# EasyEDA Pro project FOC12.epro, schematic Schematic1
Board Name: 驱动板; Create Date: 2024-12-24; Page Name: P1; Project Name: FOC12; Schematic Name: Schematic1; Update Date: 2025-05-16; Company: 嘉立创EDA; Drawed: Solituder; Page Size: A4; Version: V8.0
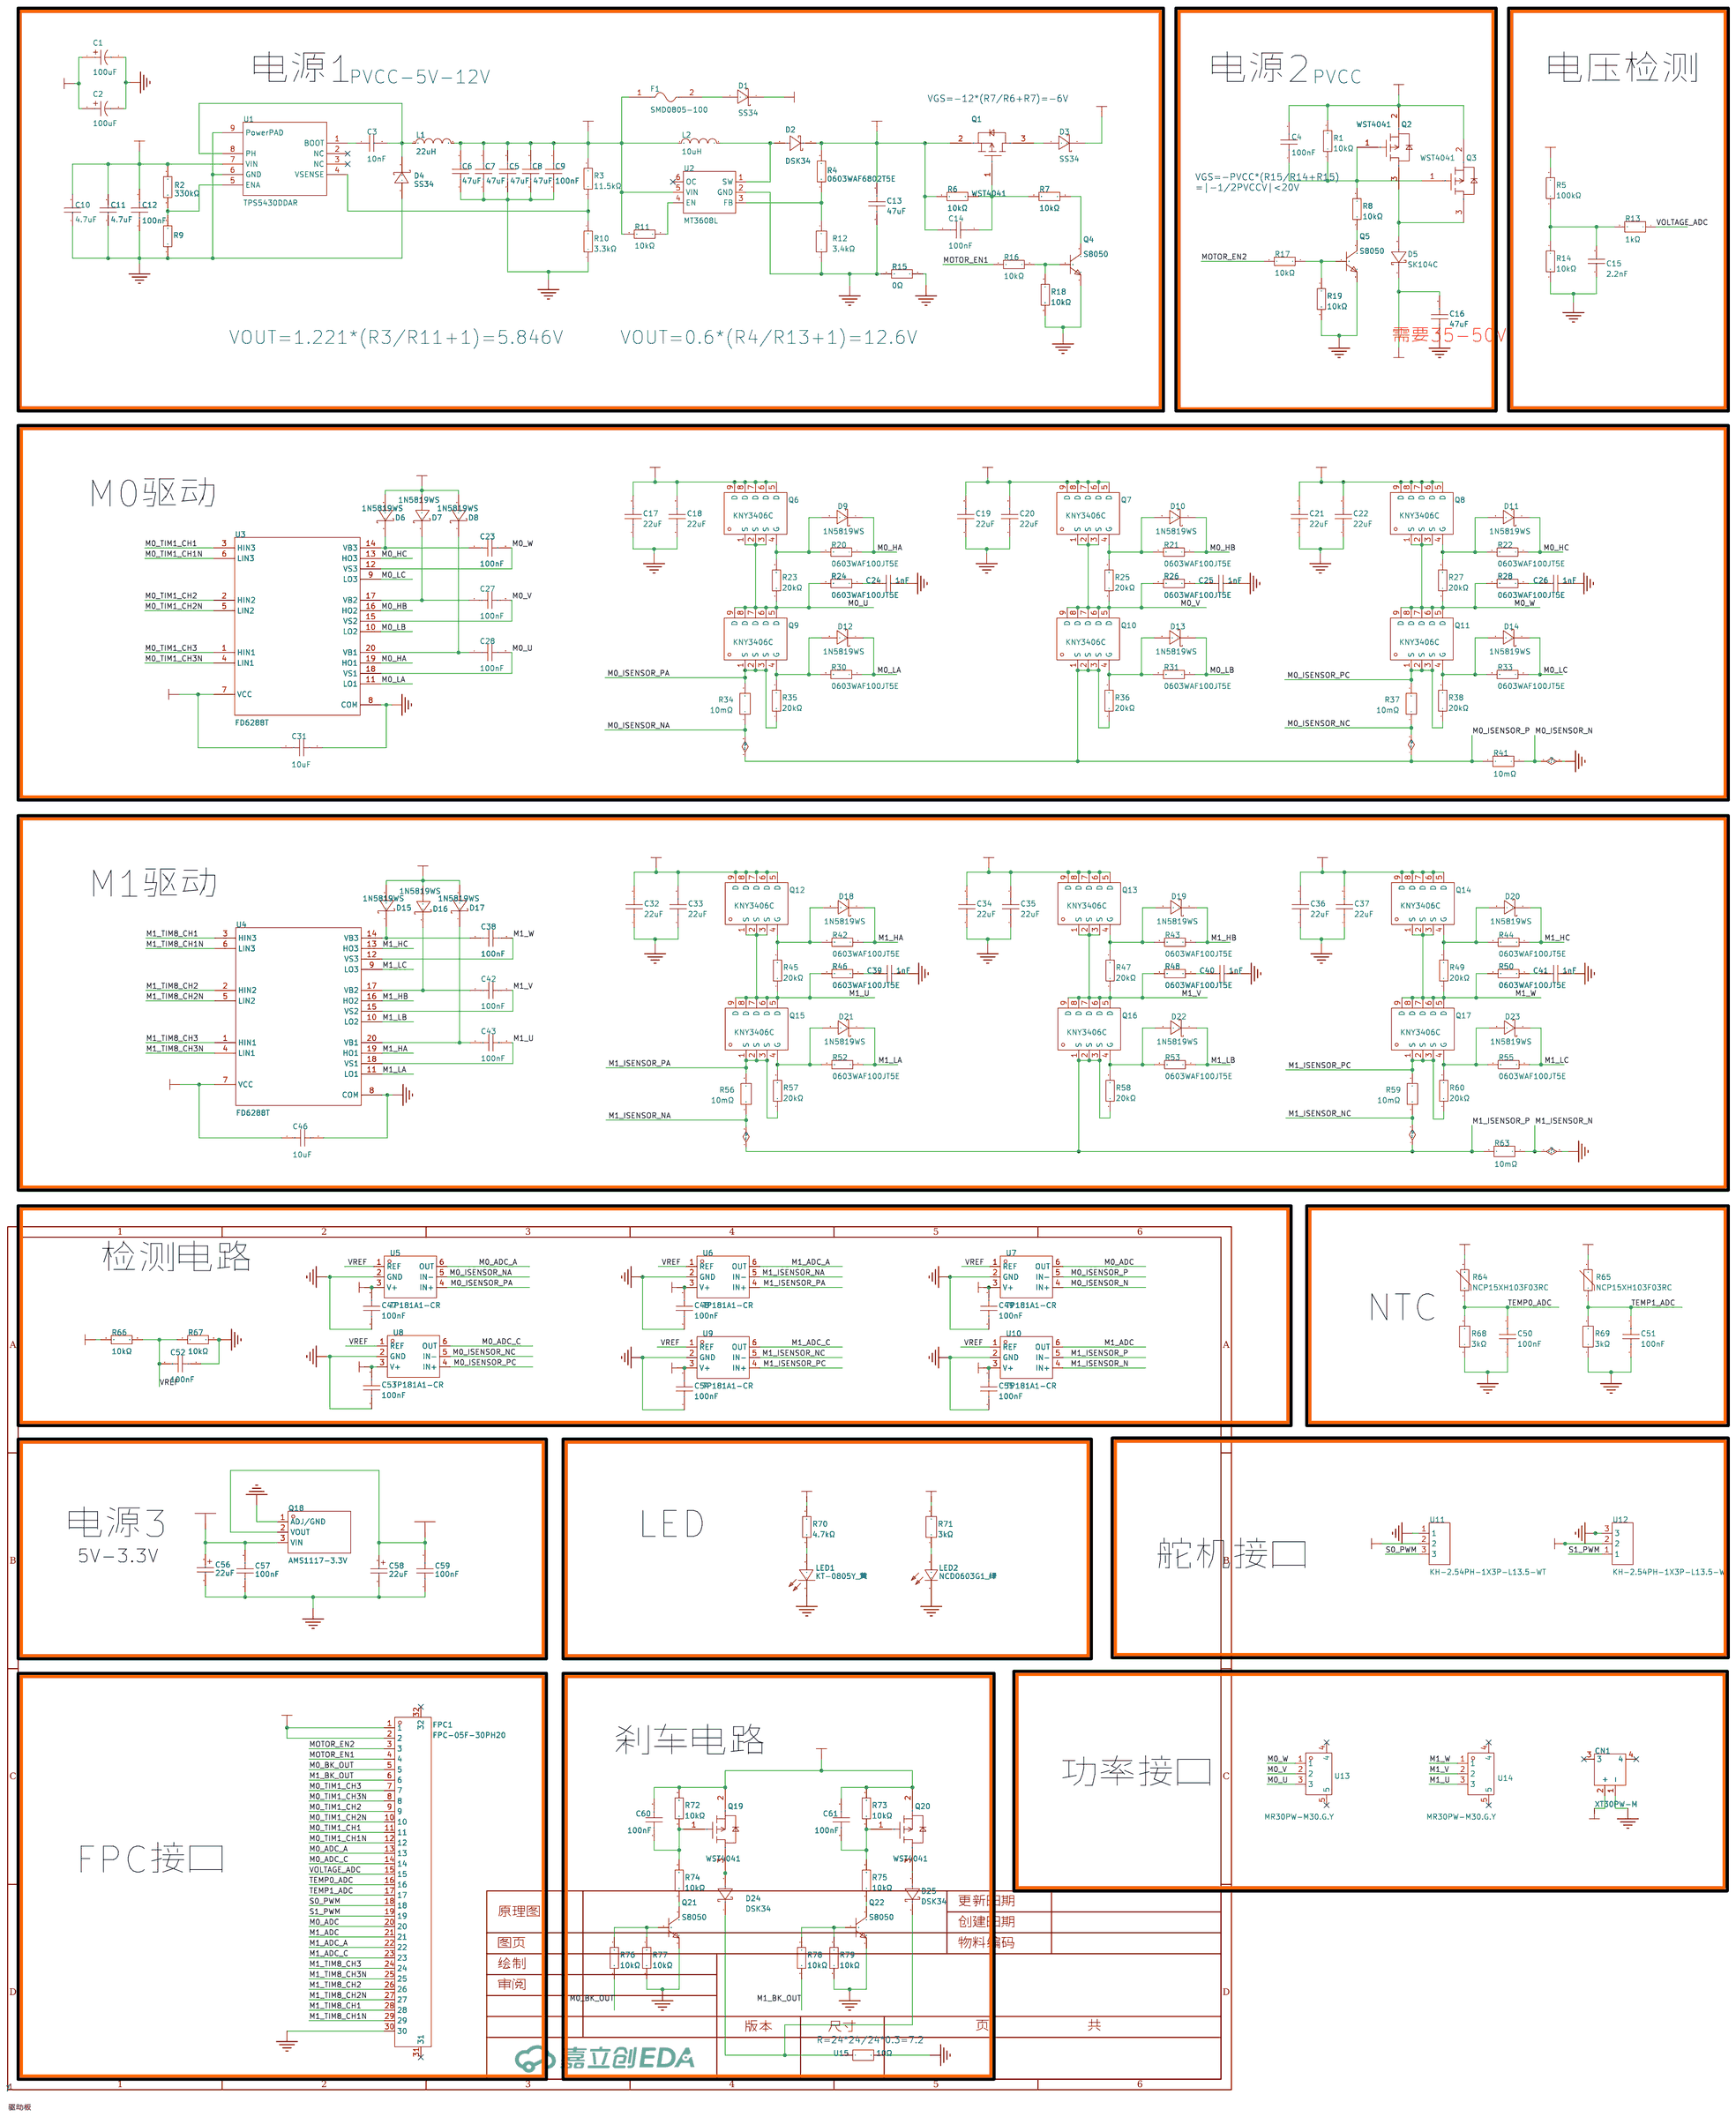
[diagram p0: schematic sheet]

## Parts
C1  100uF  [CAP-SMD_BD10.0-L10.3-W10.3-FD]
C2  100uF  [CAP-SMD_BD10.0-L10.3-W10.3-FD]
C3  10nF  [C0603]
C4  100nF  [C0603]
C5  47uF  [C1206]
C6  47uF  [C1206]
C7  47uF  [C1206]
C8  47uF  [C1206]
C9  100nF  [C0603]
C10  4.7uF  [C0805]
C11  4.7uF  [C0805]
C12  100nF  [C0603]
C13  47uF  [C1206]
C14  100nF  [C0603]
C15  2.2nF  [C0402]
C16  47uF  [C1206]
C17  22uF  [C1206]
C18  22uF  [C1206]
C19  22uF  [C1206]
C20  22uF  [C1206]
C21  22uF  [C1206]
C22  22uF  [C1206]
C23  100nF  [C0603]
C24  1nF  [C0402]
C25  1nF  [C0402]
C26  1nF  [C0402]
C27  100nF  [C0603]
C28  100nF  [C0603]
C31  10uF  [C0805]
C32  22uF  [C1206]
C33  22uF  [C1206]
C34  22uF  [C1206]
C35  22uF  [C1206]
C36  22uF  [C1206]
C37  22uF  [C1206]
C38  100nF  [C0603]
C39  1nF  [C0402]
C40  1nF  [C0402]
C41  1nF  [C0402]
C42  100nF  [C0603]
C43  100nF  [C0603]
C46  10uF  [C0805]
C47  100nF  [C0402]
C48  100nF  [C0402]
C49  100nF  [C0402]
C50  100nF  [C0603]
C51  100nF  [C0603]
C52  100nF  [C0402]
C53  100nF  [C0402]
C54  100nF  [C0402]
C55  100nF  [C0402]
C56  22uF  [CASE-A_3216]
C57  100nF  [C0603]
C58  22uF  [CASE-A_3216]
C59  100nF  [C0603]
C60  100nF  [C0603]
C61  100nF  [C0603]
CN1  XT30PW-M  [CONN-TH_XT30PW-M]
D1  SS34  [SMA_L4.3-W2.6-LS5.2-RD]
D2  DSK34  [SOD-123FL_L2.7-W1.8-LS3.8-RD]
D3  SS34  [SMA_L4.3-W2.6-LS5.2-RD]
D4  SS34  [SMA_L4.3-W2.6-LS5.2-RD]
D5  SK104C  [SMC_L6.9-W5.9-LS7.9-RD]
D6  1N5819WS  [SOD-323_L1.8-W1.3-LS2.5-RD]
D7  1N5819WS  [SOD-323_L1.8-W1.3-LS2.5-RD]
D8  1N5819WS  [SOD-323_L1.8-W1.3-LS2.5-RD]
D9  1N5819WS  [SOD-323_L1.8-W1.3-LS2.5-RD]
D10  1N5819WS  [SOD-323_L1.8-W1.3-LS2.5-RD]
D11  1N5819WS  [SOD-323_L1.8-W1.3-LS2.5-RD]
D12  1N5819WS  [SOD-323_L1.8-W1.3-LS2.5-RD]
D13  1N5819WS  [SOD-323_L1.8-W1.3-LS2.5-RD]
D14  1N5819WS  [SOD-323_L1.8-W1.3-LS2.5-RD]
D15  1N5819WS  [SOD-323_L1.8-W1.3-LS2.5-RD]
D16  1N5819WS  [SOD-323_L1.8-W1.3-LS2.5-RD]
D17  1N5819WS  [SOD-323_L1.8-W1.3-LS2.5-RD]
D18  1N5819WS  [SOD-323_L1.8-W1.3-LS2.5-RD]
D19  1N5819WS  [SOD-323_L1.8-W1.3-LS2.5-RD]
D20  1N5819WS  [SOD-323_L1.8-W1.3-LS2.5-RD]
D21  1N5819WS  [SOD-323_L1.8-W1.3-LS2.5-RD]
D22  1N5819WS  [SOD-323_L1.8-W1.3-LS2.5-RD]
D23  1N5819WS  [SOD-323_L1.8-W1.3-LS2.5-RD]
D24  DSK34  [SOD-123FL_L2.7-W1.8-LS3.8-RD]
D25  DSK34  [SOD-123FL_L2.7-W1.8-LS3.8-RD]
F1  SMD0805-100  [F0805]
FPC1  FPC-05F-30PH20  [FPC-SMD_30P-P0.50_XUNPU_FPC-05F-30PH20]
L1  22uH  [IND-SMD_L7.3-W6.6_MHCI06030]
L2  10uH  [IND-SMD_L5.4-W5.2_FXL0530]
LED1  KT-0805Y_黄  [LED0805-R-RD]
LED2  NCD0603G1_绿  [LED0603-RD_1]
Q1  WST4041  [SOT-23_L2.9-W1.3-P1.90-LS2.4-BR]
Q2  WST4041  [SOT-23_L2.9-W1.3-P1.90-LS2.4-BR]
Q3  WST4041  [SOT-23_L2.9-W1.3-P1.90-LS2.4-BR]
Q4  S8050  [SOT-23-3_L2.9-W1.3-P1.90-LS2.4-BR]
Q5  S8050  [SOT-23-3_L2.9-W1.3-P1.90-LS2.4-BR]
Q6  KNY3406C  [PDFN-8_L4.9-W5.8-P1.27-LS6.1-BL]
Q7  KNY3406C  [PDFN-8_L4.9-W5.8-P1.27-LS6.1-BL]
Q8  KNY3406C  [PDFN-8_L4.9-W5.8-P1.27-LS6.1-BL]
Q9  KNY3406C  [PDFN-8_L4.9-W5.8-P1.27-LS6.1-BL]
Q10  KNY3406C  [PDFN-8_L4.9-W5.8-P1.27-LS6.1-BL]
Q11  KNY3406C  [PDFN-8_L4.9-W5.8-P1.27-LS6.1-BL]
Q12  KNY3406C  [PDFN-8_L4.9-W5.8-P1.27-LS6.1-BL]
Q13  KNY3406C  [PDFN-8_L4.9-W5.8-P1.27-LS6.1-BL]
Q14  KNY3406C  [PDFN-8_L4.9-W5.8-P1.27-LS6.1-BL]
Q15  KNY3406C  [PDFN-8_L4.9-W5.8-P1.27-LS6.1-BL]
Q16  KNY3406C  [PDFN-8_L4.9-W5.8-P1.27-LS6.1-BL]
Q17  KNY3406C  [PDFN-8_L4.9-W5.8-P1.27-LS6.1-BL]
Q18  AMS1117-3.3V  [SOT-89-3_L4.5-W2.5-P1.50-LS4.2-BR]
Q19  WST4041  [SOT-23_L2.9-W1.3-P1.90-LS2.4-BR]
Q20  WST4041  [SOT-23_L2.9-W1.3-P1.90-LS2.4-BR]
Q21  S8050  [SOT-23-3_L2.9-W1.3-P1.90-LS2.4-BR]
Q22  S8050  [SOT-23-3_L2.9-W1.3-P1.90-LS2.4-BR]
R1  10kΩ  [R0402]
R2  330kΩ  [R0603]
R3  11.5kΩ  [R0402]
R4  0603WAF6802T5E  [R0603]
R5  100kΩ  [R0402]
R6  10kΩ  [R0402]
R7  10kΩ  [R0402]
R8  10kΩ  [R0402]
R9  0603WAF6802T5E  [R0603]
R10  3.3kΩ  [R0402]
R11  10kΩ  [R0402]
R12  3.4kΩ  [R0603]
R13  1kΩ  [R0402]
R14  10kΩ  [R0402]
R15  0Ω  [R0603]
R16  10kΩ  [R0402]
R17  10kΩ  [R0402]
R18  10kΩ  [R0402]
R19  10kΩ  [R0402]
R20  0603WAF100JT5E  [R0603]
R21  0603WAF100JT5E  [R0603]
R22  0603WAF100JT5E  [R0603]
R23  20kΩ  [R0402]
R24  0603WAF100JT5E  [R0603]
R25  20kΩ  [R0402]
R26  0603WAF100JT5E  [R0603]
R27  20kΩ  [R0402]
R28  0603WAF100JT5E  [R0603]
R30  0603WAF100JT5E  [R0603]
R31  0603WAF100JT5E  [R0603]
R33  0603WAF100JT5E  [R0603]
R34  10mΩ  [R2512]
R35  20kΩ  [R0402]
R36  20kΩ  [R0402]
R37  10mΩ  [R2512]
R38  20kΩ  [R0402]
R41  10mΩ  [R2512]
R42  0603WAF100JT5E  [R0603]
R43  0603WAF100JT5E  [R0603]
R44  0603WAF100JT5E  [R0603]
R45  20kΩ  [R0402]
R46  0603WAF100JT5E  [R0603]
R47  20kΩ  [R0402]
R48  0603WAF100JT5E  [R0603]
R49  20kΩ  [R0402]
R50  0603WAF100JT5E  [R0603]
R52  0603WAF100JT5E  [R0603]
R53  0603WAF100JT5E  [R0603]
R55  0603WAF100JT5E  [R0603]
R56  10mΩ  [R2512]
R57  20kΩ  [R0402]
R58  20kΩ  [R0402]
R59  10mΩ  [R2512]
R60  20kΩ  [R0402]
R63  10mΩ  [R2512]
R64  NCP15XH103F03RC  [R0402]
R65  NCP15XH103F03RC  [R0402]
R66  10kΩ  [R0402]
R67  10kΩ  [R0402]
R68  3kΩ  [R0402]
R69  3kΩ  [R0402]
R70  4.7kΩ  [R0402]
R71  3kΩ  [R0402]
R72  10kΩ  [R0402]
R73  10kΩ  [R0402]
R74  10kΩ  [R0402]
R75  10kΩ  [R0402]
R76  10kΩ  [R0402]
R77  10kΩ  [R0402]
R78  10kΩ  [R0402]
R79  10kΩ  [R0402]
U1  TPS5430DDAR  [ESOP-8_L4.9-W3.9-P1.27-LS6.0-TL-EP]
U2  MT3608L  [SOT-23-6_L2.9-W1.6-P0.95-LS2.8-BL_3]
U3  FD6288T  [TSSOP-20_L6.5-W4.4-P0.65-LS6.4-BL]
U4  FD6288T  [TSSOP-20_L6.5-W4.4-P0.65-LS6.4-BL]
U5  TP181A1-CR  [SC70-6_L2.1-W1.3-P0.65-LS2.3-BL]
U6  TP181A1-CR  [SC70-6_L2.1-W1.3-P0.65-LS2.3-BL]
U7  TP181A1-CR  [SC70-6_L2.1-W1.3-P0.65-LS2.3-BL]
U8  TP181A1-CR  [SC70-6_L2.1-W1.3-P0.65-LS2.3-BL]
U9  TP181A1-CR  [SC70-6_L2.1-W1.3-P0.65-LS2.3-BL]
U10  TP181A1-CR  [SC70-6_L2.1-W1.3-P0.65-LS2.3-BL]
U11  KH-2.54PH-1X3P-L13.5-WT  [HDR-SMD_3P-P2.54-H-M_KH-2.54PH-1X3P-L13.5-WT]
U12  KH-2.54PH-1X3P-L13.5-WT  [HDR-SMD_3P-P2.54-H-M_KH-2.54PH-1X3P-L13.5-WT]
U13  MR30PW-M30.G.Y  [CONN-TH_MR30PW-M30-G-Y]
U14  MR30PW-M30.G.Y  [CONN-TH_MR30PW-M30-G-Y]
U15  10Ω  [TO-220-2_L10.1-W4.5-P5.08-L]

## Library data of the parts
C1 C2 = VMME0841J101MV: 容值:100uF;精度:±20%;额定电压:63V;纹波电流:-;等效串联电阻:-;; LCSC Part Name: 100uF ±20% 63V; Supplier Part: C487129; Manufacturer: Ymin(永铭); Supplier Footprint: SMD,D10xL8.4mm; Datasheet: https://atta.szlcsc.com/upload/public/pdf/source/20200220/C487283_B2B02AE81BD8A6F1FEC0F15CA59E8094.pdf; Supplier: LCSC; Tolerance: ±20%; Rated Voltage: 63V
C3 = CC0603JRX7R9BB103: 容值:10nF;精度:±5%;额定电压:50V;材质(温度系数):X7R;; LCSC Part Name: 10nF ±5% 50V; Supplier Part: C115056; Manufacturer: YAGEO(国巨); Supplier Footprint: 0603; Datasheet: https://atta.szlcsc.com/upload/public/pdf/source/20170810/C115056_1502335171390879692.pdf; Supplier: LCSC; Tolerance: ±5%; Voltage Rated: 50V; Temperature Coefficient: X7R
C4 C9 C12 C14 C23 C27 C28 C38 C42 C43 C50 C51 C57 C59-C61 = CC0603KRX7R9BB104: 容值:100nF;精度:±10%;额定电压:50V;材质(温度系数):X7R;; LCSC Part Name: 100nF ±10% 50V; Supplier Part: C14663; Manufacturer: YAGEO(国巨); Supplier Footprint: 0603; Datasheet: https://atta.szlcsc.com/upload/public/pdf/source/20170116/1484561234239.pdf; Supplier: LCSC; Tolerance: ±10%; Voltage Rated: 50V; Temperature Coefficient: X7R
C5-C8 C16 = HGC1206R5476M100NSPJ: 容值:47uF;精度:±20%;额定电压:10V;材质(温度系数):X5R;; LCSC Part Name: 47uF ±20% 10V; Supplier Part: C7432787; Manufacturer: Chinocera(华瓷); Supplier Footprint: 1206; Datasheet: https://atta.szlcsc.com/upload/public/pdf/source/20240320/FAC3FEC40A78BC5CCCE96C232A94D860.pdf; Supplier: LCSC; Tolerance: ±20%; Voltage Rated: 10V; Temperature Coefficient: X5R
C10 C11 = CL21A475KBQNNNE: 容值:4.7uF;精度:±10%;额定电压:50V;材质(温度系数):X5R;; LCSC Part Name: 4.7uF ±10% 50V; Supplier Part: C98192; Manufacturer: SAMSUNG(三星); Supplier Footprint: 0805; JLCPCB Part Class: Extended Part; Datasheet: https://atta.szlcsc.com/upload/public/pdf/source/20170412/1491969149396.pdf; Supplier: LCSC; Tolerance: ±10%; Voltage Rated: 50V; Temperature Coefficient: X5R
C13 = HGC1206R5476M250NSPJ: 容值:47uF;精度:±20%;额定电压:25V;材质(温度系数):X5R;; LCSC Part Name: 47uF ±20% 25V; Supplier Part: C22367835; Manufacturer: Chinocera(华瓷); Supplier Footprint: 1206; JLCPCB Part Class: 扩展库; Datasheet: https://atta.szlcsc.com/upload/public/pdf/source/20240326/E6CB0DC43BB858B74F4352229FABFDCA.pdf; Supplier: LCSC; Tolerance: ±20%; Voltage Rated: 25V; Temperature Coefficient: X5R
C15 = 0402B222K500NT: 容值:2.2nF;精度:±10%;额定电压:50V;材质(温度系数):X7R;; LCSC Part Name: 2.2nF ±10% 50V; Supplier Part: C1531; Manufacturer: FH(风华); Supplier Footprint: 0402; JLCPCB Part Class: Basic Part; Datasheet: https://atta.szlcsc.com/upload/public/pdf/source/20170923/C1531_1506149258433988338.pdf; Supplier: LCSC; Tolerance: ±10%; Voltage Rated: 50V; Temperature Coefficient: X7R
C17-C22 C32-C37 = CGA1206X5R226M350NT: 容值:22uF;精度:±20%;额定电压:35V;材质(温度系数):X5R;; LCSC Part Name: 22uF ±20% 35V; Supplier Part: C6119969; Manufacturer: HRE(芯声); Supplier Footprint: 1206; JLCPCB Part Class: 扩展库; Supplier: LCSC; Tolerance: ±20%; Voltage Rated: 35V; Temperature Coefficient: X5R
C24-C26 C39-C41 = CC0402KRX7R9BB102: 容值:1nF;精度:±10%;额定电压:50V;材质(温度系数):X7R;; LCSC Part Name: 1nF ±10% 50V; Supplier Part: C106205; Manufacturer: YAGEO(国巨); Supplier Footprint: 0402; JLCPCB Part Class: Extended Part; Datasheet: https://atta.szlcsc.com/upload/public/pdf/source/20171226/C106205_15142609593391205665.pdf; Supplier: LCSC; Tolerance: ±10%; Voltage Rated: 50V; Temperature Coefficient: X7R
C31 C46 = HGC0805R5106K500NSLJ: 容值:10uF;精度:±10%;额定电压:50V;材质(温度系数):X5R;; LCSC Part Name: 10uF ±10% 50V; Supplier Part: C22367830; Manufacturer: Chinocera(华瓷); Supplier Footprint: 0805; JLCPCB Part Class: Extended Part; Datasheet: https://atta.szlcsc.com/upload/public/pdf/source/20240326/4C0A3E12027C78BBE9280625046EA2CF.pdf; Supplier: LCSC; Tolerance: ±10%; Voltage Rated: 50V; Temperature Coefficient: X5R
C47-C49 C52-C55 = CL05B104KO5NNNC: 容值:100nF;精度:±10%;额定电压:16V;材质(温度系数):X7R;; LCSC Part Name: 100nF ±10% 16V; Supplier Part: C1525; Manufacturer: SAMSUNG(三星); Supplier Footprint: 0402; JLCPCB Part Class: 基础库; Datasheet: https://atta.szlcsc.com/upload/public/pdf/source/20160218/1457707763339.pdf; Supplier: LCSC; Tolerance: ±10%; Voltage Rated: 16V; Temperature Coefficient: X7R
C56 C58 = TAJA226K010RNJ: 容值:22uF;精度:±10%;额定电压:10V;等效串联电阻:3Ω@100kHz;; LCSC Part Name: 22uF ±10% 10V; Supplier Part: C11366; Manufacturer: Kyocera AVX; Supplier Footprint: CASE-A-3216; JLCPCB Part Class: Extended Part; Datasheet: https://atta.szlcsc.com/upload/public/pdf/source/20160107/1457707750344.pdf; Supplier: LCSC; Tolerance: ±10%; Rated Voltage: 10V; Equivalent Series Resistance(ESR): 3Ω@100kHz; Operating Temperature: -55℃~+125℃
CN1 = XT30PW-M: Socket,DCsupply,XT30,male,PIN:2; LCSC Part Name: XT30PW-M公头; Supplier Part: C431092; Manufacturer: AMASS(艾迈斯); Supplier Footprint: Through Hole; Datasheet: https://atta.szlcsc.com/upload/public/pdf/source/20220222/6A9F22F7850E25B33E1BE430ADF8560B.pdf; Supplier: LCSC
D1 D3 D4 = SS34_C8678: 二极管配置:独立式;正向压降(Vf):550mV@3A;直流反向耐压(Vr):40V;整流电流:3A;; LCSC Part Name: 电压:40V 电流:3A; Supplier Part: C8678; Manufacturer: MDD(辰达半导体); Supplier Footprint: SMA(DO-214AC); JLCPCB Part Class: 基础库; Datasheet: https://atta.szlcsc.com/upload/public/pdf/source/20230314/A80AE34493C69B89E2F4B1712F433538.pdf; Supplier: LCSC; Diode Configuration: 独立式; Forward Voltage (Vf@If): 550mV@3A; Reverse Voltage (Vr): 40V; Rectified Current: 3A; Reverse Leakage Current (Ir): 500uA@40V
D2 D24 D25 = DSK34_C7502709: 二极管配置:独立式;正向压降(Vf):550mV@3A;直流反向耐压(Vr):40V;整流电流:3A;; LCSC Part Name: 电压:40V 电流:3A; Supplier Part: C7502709; Manufacturer: 宏迦橙; Supplier Footprint: SOD-123FL; Datasheet: https://atta.szlcsc.com/upload/public/pdf/source/20240814/5E8D2EAF2EE69BEF369BE6AC64F67CC4.pdf; Supplier: LCSC; Diode Configuration: 独立式; Forward Voltage (Vf@If): 550mV@3A; Reverse Voltage (Vr): 40V; Rectified Current: 3A; Reverse Leakage Current (Ir): 500uA
D5 = SK104C_C18199211: 二极管配置:独立式;正向压降(Vf):550mV@10A;直流反向耐压(Vr):40V;整流电流:10A;; LCSC Part Name: 电压:40V 电流:10A; Supplier Part: C18199211; Manufacturer: 宏迦橙; Supplier Footprint: SMC; JLCPCB Part Class: 扩展库; Datasheet: https://atta.szlcsc.com/upload/public/pdf/source/20230925/90F2340DC9BC2B2517F18AABBBD1A464.pdf; Supplier: LCSC; Diode Configuration: 独立式; Forward Voltage (Vf@If): 550mV@10A; Reverse Voltage (Vr): 40V; Rectified Current: 10A; Reverse Leakage Current (Ir): 500uA@40V
D6-D23 = 1N5819WS_C191023: 直流反向耐压(Vr):40V;平均整流电流(Io):1A;正向压降(Vf):600mV@1A;; LCSC Part Name: 40V 1A 600mV@1A; Supplier Part: C191023; Manufacturer: Hottech(合科泰); Supplier Footprint: SOD-323; Datasheet: https://atta.szlcsc.com/upload/public/pdf/source/20180614/C191023_3C6A6398B911F3A4C23E7538EE054643.pdf; Supplier: LCSC; Reverse Voltage (Vr): 40V; Average Rectified Current (Io): 1A; Forward Voltage (Vf@If): 600mV@1A
F1 = SMD0805-100: 最大电压:6V;最大电流:100A;保持电流:1A;跳闸电流:1.95A;; LCSC Part Name: 1A  6V 自恢复保险丝; Supplier Part: C70061; Manufacturer: 台湾陆海; Supplier Footprint: 0805; JLCPCB Part Class: Extended Part; Datasheet: https://atta.szlcsc.com/upload/public/pdf/source/20160331/1459396375879.pdf; Supplier: LCSC; Operating Voltage (Max): 6V; Current Rating (Max): 100A; Hold Current: 1A; Trip Current: 1.95A
FPC1 = FPC-05F-30PH20: 锁定特性:翻盖式;触点类型:下接;触点数量:30P;间距:0.5mm;安装类型:卧贴;工作温度范围:-25℃~+85℃;; LCSC Part Name: 间距:0.5mm P数:30P 翻盖式 下接; Supplier Part: C2856808; Manufacturer: XUNPU(讯普); Supplier Footprint: SMD,P=0.5mm,卧贴; JLCPCB Part Class: 扩展库; Datasheet: https://atta.szlcsc.com/upload/public/pdf/source/20210922/C2856808_4E6DDE2793CFD9EF09B771A8BD3338A4.pdf; Supplier: LCSC; Locking Feature: 翻盖式; Contact Type: 下接; Number of Contacts: 30P; Pitch: 0.5mm; Mounting Type: 卧贴; FFC, FCB Thickness: 0.3mm; Height Above Board: 2mm; Operating Temperature Range: -25℃~+85℃
L1 = SMMS0630-220M: 电感值:22uH;精度:±20%;额定电流:-;直流电阻(DCR):-;; LCSC Part Name: 22uH ±20%; Supplier Part: C128694; Manufacturer: SXN(顺翔诺); Supplier Footprint: SMD,7.3x6.6x3mm; JLCPCB Part Class: Extended Part; Datasheet: https://atta.szlcsc.com/upload/public/pdf/source/20210810/BBF24330FB2F5029F637830BA9C42C0D.pdf; Supplier: LCSC; Tolerance: ±20%
L2 = FXL0530-100-M: 电感值:10uH;精度:±20%;额定电流:3.2A;饱和电流(Isat):3.5A;直流电阻(DCR):110mΩ;; LCSC Part Name: 10uh ±20% 3.2A 110mΩ; Supplier Part: C177248; Manufacturer: cjiang(长江微电); Supplier Footprint: SMD,0503; JLCPCB Part Class: Extended Part; Datasheet: https://atta.szlcsc.com/upload/public/pdf/source/20190322/C177248_25CC57904FA999A3205A4A95182FDDD8.pdf; Supplier: LCSC; Tolerance: ±20%; Rated Current: 3.2A; Saturation Current (Isat): 3.5A; DC Resistance (DCR): 110mΩ
LED1 = KT-0805Y: 发光颜色:黄色;功率:-;正向电流:-;主波长:-;二极管配置:-;透镜颜色:-;色温:-;发光角度:-;载带方式:-;工作温度:-;; LCSC Part Name: 0805 黄灯 高亮; Supplier Part: C2296; Manufacturer: KENTO; Supplier Footprint: 0805; JLCPCB Part Class: Basic Part; Datasheet: https://atta.szlcsc.com/upload/public/pdf/source/20160421/1461205044170.pdf; Supplier: LCSC; Emitted Color: 黄色
LED2 = NCD0603G1: 发光颜色:翠绿色;正向电压(VF):2.6V~3.6V;功率:72mW;正向电流:10mA;主波长:515nm~530nm;透镜颜色:无色透明透镜;发光强度:330mcd~900mcd;发光角度:130°;工作温度:-30℃~+85℃;; Supplier Part: C84267; Manufacturer: 国星光电; Supplier Footprint: 0603; JLCPCB Part Class: Extended Part; Datasheet: https://atta.szlcsc.com/upload/public/pdf/source/20200820/C84267_04BA7703640BAC111D09F5EFB971FBF3.pdf; Supplier: LCSC; Emitted Color: 翠绿色; Forward Voltage (VF): 2.6V~3.6V; Power Dissipation: 72mW; Forward Current: 10mA; Dominant Wavelength: 515nm~530nm; Lens Color: 无色透明透镜; Luminous Intensity: 330mcd~900mcd; Viewing Angle: 130°; Operating Temperature: -30℃~+85℃
Q1-Q3 Q19 Q20 = WST4041: 类型:1个P沟道;漏源电压(Vdss):40V;连续漏极电流(Id):6A;功率(Pd):1.4W;导通电阻(RDS(on)@Vgs,Id):40mΩ@10V,3A;阈值电压(Vgs(th)@Id):2.2V@250uA;; LCSC Part Name: 1个P沟道 耐压:40V 电流:6A; Supplier Part: C148357; Manufacturer: WINSOK(微硕); Supplier Footprint: SOT-23; Datasheet: https://atta.szlcsc.com/upload/public/pdf/source/20171122/C148357_15113333715721134004.pdf; Supplier: LCSC; Type: 1个P沟道; Drain Source Voltage (Vdss): 40V; Continuous Drain Current (Id): 6A; Power Dissipation (Pd): 1.4W; Drain Source On Resistance (RDS(on)@Vgs,Id): 40mΩ@10V,3A; Gate Threshold Voltage (Vgs(th)@Id): 2.2V@250uA
Q4 Q5 Q21 Q22 = S8050: NPN 25V 500mA 120-400 SOT-23; Supplier Part: C2931719; Manufacturer: Doeshare(德芯); Supplier Footprint: SOT-23; Datasheet: https://atta.szlcsc.com/upload/public/pdf/source/20220117/E6D3315E0D6ADDB25840BFFAC039C5C0.pdf; Supplier: LCSC
Q6-Q17 = KNY3406C: 类型:N沟道;漏源电压(Vdss):60V;连续漏极电流(Id):80A;功率(Pd):41W;导通电阻(RDS(on)@Vgs,Id):8.5mΩ@10V,10A;阈值电压(Vgs(th)@Id):2.5V@250μA;; LCSC Part Name: N沟道 60V 80A; Supplier Part: C455987; Manufacturer: KIA 半导体; Supplier Footprint: DFN(5x6); JLCPCB Part Class: Extended Part; Datasheet: https://atta.szlcsc.com/upload/public/pdf/source/20191114/C455987_5B27682C33C31BB0F5A9BF4BAD1962A9.pdf; Supplier: LCSC; Type: N沟道; Drain Source Voltage (Vdss): 60V; Continuous Drain Current (Id): 80A; Drain Source On Resistance (RDS(on)@Vgs,Id): 8.5mΩ@10V,10A; Power Dissipation (Pd): 41W; Gate Threshold Voltage (Vgs(th)@Id): 2.5V@250μA
Q18 = AMS1117-3.3V_C5120796: 输出类型:固定;最大输入电压:18V;输出电压:3.3V;最大输出电流:1A;输出极性:正极;; LCSC Part Name: 输入18V 输出3.3V 1A; Supplier Part: C5120796; Manufacturer: MSKSEMI(美森科); Supplier Footprint: SOT-89; Datasheet: https://atta.szlcsc.com/upload/public/pdf/source/20220727/5E62EAC46FFFF83337622C0FBE1B6BF8.pdf; Supplier: LCSC; Output Type: 固定; Maximum Input Voltage: 18V; Output Voltage: 3.3V; MAX Output Current: 1A; Dropout Voltage: 1.4V@(1A); standby current: 12mA; Operating Temperature: 0℃~+125℃; Output Polarity: 正极; Number of Outputs: 1
R1 R6-R8 R11 R14 R16-R19 R66 R67 R72-R79 = 0402WGF1002TCE: 电阻类型:厚膜电阻;阻值:10kΩ;精度:±1%;功率:62.5mW;温度系数:±100ppm/℃;最大工作电压:50V;工作温度范围:-55℃~+155℃;; LCSC Part Name: 10kΩ ±1% 62.5mW; Supplier Part: C25744; Manufacturer: UNI-ROYAL(厚声); Supplier Footprint: 0402; JLCPCB Part Class: Basic Part; Datasheet: https://atta.szlcsc.com/upload/public/pdf/source/20200306/C422600_1E6D84923E4A46A82E41ADD87F860B5C.pdf; Supplier: LCSC; Type: 厚膜电阻; Tolerance: ±1%; Power(Watts): 62.5mW; Overload Voltage (Max): 50V; Temperature Coefficient: ±100ppm/℃; Operating Temperature Range: -55℃~+155℃
R2 = 0603WAF3303T5E: 电阻类型:厚膜电阻;阻值:330kΩ;精度:±1%;功率:1/10W;温度系数:±100ppm/℃;最大工作电压:75V;工作温度范围:-55℃~+155℃;; LCSC Part Name: 330kΩ ±1%; Supplier Part: C23137; Manufacturer: UNI-ROYAL(厚声); Supplier Footprint: 0603; JLCPCB Part Class: Basic Part; Datasheet: https://atta.szlcsc.com/upload/public/pdf/source/20200306/C422600_1E6D84923E4A46A82E41ADD87F860B5C.pdf; Supplier: LCSC; Type: 厚膜电阻; Tolerance: ±1%; Power(Watts): 1/10W; Overload Voltage (Max): 75V; Temperature Coefficient: ±100ppm/℃; Operating Temperature Range: -55℃~+155℃
R3 = 0402WGF1152TCE: 电阻类型:厚膜电阻;阻值:11.5kΩ;精度:±1%;功率:62.5mW;最大工作电压:50V;温度系数:±100ppm/℃;; LCSC Part Name: 11.5kΩ ±1% 62.5mW 厚膜电阻; Supplier Part: C270653; Manufacturer: UNI-ROYAL(厚声); Supplier Footprint: 0402; JLCPCB Part Class: 扩展库; Datasheet: https://atta.szlcsc.com/upload/public/pdf/source/20200306/C422600_1E6D84923E4A46A82E41ADD87F860B5C.pdf; Supplier: LCSC; Type: 厚膜电阻; Tolerance: ±1%; Power(Watts): 62.5mW; Overload Voltage (Max): 50V; Temperature Coefficient: ±100ppm/℃; Operating Temperature Range: -55℃~+155℃
R4 R9 = 0603WAF6802T5E: LCSC Part Name: 68KΩ(6802) ±1% 编带; Supplier Part: C23231; Manufacturer: UNI-ROYAL(厚声); Supplier Footprint: 0603; JLCPCB Part Class: Basic Part; Datasheet: https://atta.szlcsc.com/upload/public/pdf/source/20170920/C23231_1505901145876982612.pdf; Supplier: LCSC
R5 = 0402WGF1003TCE: 功率:1/16W;精度:±1%;温度系数:±100ppm/℃;阻值:100kΩ;最大工作电压:50V;工作温度范围:-55℃~+155℃;; LCSC Part Name: 100KΩ ±1%; Supplier Part: C25741; Manufacturer: UNI-ROYAL(厚声); Supplier Footprint: 0402; JLCPCB Part Class: Basic Part; Datasheet: https://atta.szlcsc.com/upload/public/pdf/source/20180314/0E2614623E0414D50D3004040B0D85FE.pdf; Supplier: LCSC; Tolerance: ±1%; Power(Watts): 1/16W; Overload Voltage (Max): 50V; Temperature Coefficient: ±100ppm/℃; Operating Temperature Range: -55℃~+155℃
R10 = 0402WGF3301TCE: 电阻类型:厚膜电阻;阻值:3.3kΩ;精度:±1%;功率:62.5mW;温度系数:±100ppm/℃;最大工作电压:50V;工作温度范围:-55℃~+155℃;; LCSC Part Name: 3.3kΩ ±1% 62.5mW; Supplier Part: C25890; Manufacturer: UNI-ROYAL(厚声); Supplier Footprint: 0402; JLCPCB Part Class: Basic Part; Datasheet: https://atta.szlcsc.com/upload/public/pdf/source/20200306/C422600_1E6D84923E4A46A82E41ADD87F860B5C.pdf; Supplier: LCSC; Type: 厚膜电阻; Tolerance: ±1%; Power(Watts): 62.5mW; Overload Voltage (Max): 50V; Temperature Coefficient: ±100ppm/℃; Operating Temperature Range: -55℃~+155℃
R12 = FRC0603F3401TS: 电阻类型:厚膜电阻;阻值:3.4kΩ;精度:±1%;功率:100mW;最大工作电压:75V;温度系数:±100ppm/℃;; LCSC Part Name: 3.4kΩ ±1% 100mW 厚膜电阻; Supplier Part: C2933201; Manufacturer: FOJAN(富捷); Supplier Footprint: 0603; JLCPCB Part Class: 扩展库; Datasheet: https://atta.szlcsc.com/upload/public/pdf/source/20211221/925EC7D7225764EE0046F22065062C87.pdf; Supplier: LCSC; Type: 厚膜电阻; Tolerance: ±1%; Power(Watts): 100mW; Overload Voltage (Max): 75V; Temperature Coefficient: ±100ppm/℃; Operating Temperature Range: -55℃~+155℃
R13 = FRC0402J102 TS: 电阻类型:厚膜电阻;阻值:1kΩ;精度:±5%;功率:62.5mW;最大工作电压:50V;温度系数:±100ppm/℃;; LCSC Part Name: 1kΩ ±5% 62.5mW 厚膜电阻; Supplier Part: C2906899; Manufacturer: FOJAN(富捷); Supplier Footprint: 0402; JLCPCB Part Class: 扩展库; Datasheet: https://atta.szlcsc.com/upload/public/pdf/source/20211221/925EC7D7225764EE0046F22065062C87.pdf; Supplier: LCSC; Type: 厚膜电阻; Tolerance: ±5%; Power(Watts): 62.5mW; Overload Voltage (Max): 50V; Temperature Coefficient: ±100ppm/℃; Operating Temperature Range: -55℃~+155℃
R15 = 0603WAF0000T5E: 温度系数:-;精度:±1%;阻值:0Ω;功率:1/10W;最大工作电压:75V;工作温度范围:-55℃~+155℃;; LCSC Part Name: 0Ω ±1%; Supplier Part: C21189; Manufacturer: UNI-ROYAL(厚声); Supplier Footprint: 0603; Datasheet: https://atta.szlcsc.com/upload/public/pdf/source/20170920/C21189_1505887441435980537.pdf; Supplier: LCSC; Tolerance: ±1%; Power(Watts): 1/10W; Overload Voltage (Max): 75V; Operating Temperature Range: -55℃~+155℃
R20-R22 R24 R26 R28 R30 R31 R33 R42-R44 R46 R48 R50 R52 R53 R55 = 0603WAF100JT5E: LCSC Part Name: 10Ω(10R0) ±1% 编带; Supplier Part: C22859; Manufacturer: UNI-ROYAL(厚声); Supplier Footprint: 0603; JLCPCB Part Class: Basic Part; Datasheet: https://atta.szlcsc.com/upload/public/pdf/source/20170920/C22859_1505900954295982249.pdf; Supplier: LCSC
R23 R25 R27 R35 R36 R38 R45 R47 R49 R57 R58 R60 = 0402WGF2002TCE: 电阻类型:厚膜电阻;阻值:20kΩ;精度:±1%;功率:62.5mW;温度系数:±100ppm/℃;最大工作电压:50V;工作温度范围:-55℃~+155℃;; LCSC Part Name: 20kΩ ±1% 62.5mW; Supplier Part: C25765; Manufacturer: UNI-ROYAL(厚声); Supplier Footprint: 0402; JLCPCB Part Class: Basic Part; Datasheet: https://atta.szlcsc.com/upload/public/pdf/source/20200306/C422600_1E6D84923E4A46A82E41ADD87F860B5C.pdf; Supplier: LCSC; Type: 厚膜电阻; Tolerance: ±1%; Power(Watts): 62.5mW; Overload Voltage (Max): 50V; Temperature Coefficient: ±100ppm/℃; Operating Temperature Range: -55℃~+155℃
R34 R37 R41 R56 R59 R63 = PA2512FKE7T0R01E: 电阻类型:采样电阻;阻值:10mΩ;精度:±1%;额定压降:-;功率:3W;温度系数:±50ppm/℃;安装方式:-;; LCSC Part Name: 10mΩ ±1% 3W; Supplier Part: C375691; Manufacturer: YAGEO(国巨); Supplier Footprint: 2512; JLCPCB Part Class: 扩展库; Datasheet: https://atta.szlcsc.com/upload/public/pdf/source/20190227/C375693_219964CC8B3EBD36DBDF701587FA5938.pdf; Supplier: LCSC; Type: 采样电阻; Tolerance: ±1%; Power(Watts): 3W; Temperature Coefficient: ±50ppm/℃
R64 R65 = NCP15XH103F03RC: 阻值(25℃):10kΩ;B值(25℃/50℃):3380K;电阻精度:±1%;功率:100mW;B值精度:±1%;最大稳态电流(25℃):310uA;; LCSC Part Name: 10kΩ 电阻精度:±1% 3380K; Supplier Part: C77131; Manufacturer: muRata(村田); Supplier Footprint: 0402; JLCPCB Part Class: 扩展库; Datasheet: https://atta.szlcsc.com/upload/public/pdf/source/20191017/C437581_F6360BF8E6A38281D0EED84DF6C92458.pdf; Supplier: LCSC; Resistance @ 25℃: 10kΩ; B Constant (25℃/50℃): 3380K; Resistance Tolerance: ±1%; B Constant (25℃/85℃): 3434K; B Constant (25℃/100℃): 3455K; Power: 100mW; B Constant Tolerance: ±1%; Steady State Current (Max): 310uA; Operating Temperature: -40℃~+125℃
R68 R69 R71 = FRC0402F3001TS: 电阻类型:厚膜电阻;阻值:3kΩ;精度:±1%;功率:62.5mW;最大工作电压:50V;温度系数:±100ppm/℃;; LCSC Part Name: 3kΩ ±1% 62.5mW 厚膜电阻; Supplier Part: C2909355; Manufacturer: FOJAN(富捷); Supplier Footprint: 0402; Datasheet: https://atta.szlcsc.com/upload/public/pdf/source/20211221/925EC7D7225764EE0046F22065062C87.pdf; Supplier: LCSC; Type: 厚膜电阻; Tolerance: ±1%; Power(Watts): 62.5mW; Overload Voltage (Max): 50V; Temperature Coefficient: ±100ppm/℃; Operating Temperature Range: -55℃~+155℃
R70 = 0402WGF4701TCE: 电阻类型:厚膜电阻;阻值:4.7kΩ;精度:±1%;功率:1/16W;温度系数:±100ppm/℃;最大工作电压:50V;工作温度范围:-55℃~+155℃;; LCSC Part Name: 4.7kΩ ±1% 1/16W; Supplier Part: C25900; Manufacturer: UNI-ROYAL(厚声); Supplier Footprint: 0402; JLCPCB Part Class: Basic Part; Datasheet: https://atta.szlcsc.com/upload/public/pdf/source/20200306/C422600_1E6D84923E4A46A82E41ADD87F860B5C.pdf; Supplier: LCSC; Type: 厚膜电阻; Tolerance: ±1%; Power(Watts): 1/16W; Overload Voltage (Max): 50V; Temperature Coefficient: ±100ppm/℃; Operating Temperature Range: -55℃~+155℃
U1 = TPS5430DDAR: 功能类型:降压型;输出类型:可调;工作电压:5.5V~36V;输出电压:1.221V~32.04V;输出电流:3A;; LCSC Part Name: 宽输入范围、3A输出电流的降压转换器; Supplier Part: C9864; Manufacturer: TI(德州仪器); Supplier Footprint: SOIC-8-EP; JLCPCB Part Class: 基础库; Datasheet: https://www.ti.com/cn/lit/gpn/tps5430; Supplier: LCSC; Function: 降压型; Output Type: 可调; Input Voltage: 5.5V~36V; Output Voltage: 1.221V~32.04V; Output Current: 3A; Switching Frequency: 500kHz; Operating Temperature: -40℃~+125℃@(TJ); Synchronous Rectification: 否; Number of Outputs: 1; Topology: 降压式; Switch tube (built-in/external): 内置
U2 = MT3608L: 工作电压:2.2V~16V;输出电流:2.5A;; LCSC Part Name: 高效2.5A 1.2MHz升压转换器; Supplier Part: C2932326; Manufacturer: 西安航天民芯; Supplier Footprint: SOT-23-6; JLCPCB Part Class: 扩展库; Datasheet: https://atta.szlcsc.com/upload/public/pdf/source/20211213/953A62CC1033762E00AABAD4906DD7F1.pdf; Supplier: LCSC; Input Voltage: 2.2V~16V; Output Current: 2.5A; Number of Outputs: 1
U3 U4 = FD6288T: 三个独立的半桥栅极驱动集成电路芯片; Supplier Part: C97683; Manufacturer: Fortior Tech(峰岹); Supplier Footprint: TSSOP-20; Datasheet: https://atta.szlcsc.com/upload/public/pdf/source/20241101/0E2856EB301EAFFED732065FB088D773.pdf; Supplier: LCSC
U5-U10 = TP181A1-CR: Supplier Part: C2902349; Manufacturer: 3PEAK(思瑞浦); Supplier Footprint: SC70-6; JLCPCB Part Class: 扩展库; Datasheet: https://atta.szlcsc.com/upload/public/pdf/source/20230301/6D62DABF8769A8088870FFE026FF2C6D.pdf; Supplier: LCSC
U11 U12 = KH-2.54PH-1X3P-L13.5-WT: 插针结构:1x3P;间距:2.54mm;安装类型:卧贴;排数:单排;; LCSC Part Name: 1x3P 间距:2.54mm 卧贴; Supplier Part: C20610212; Manufacturer: kinghelm(金航标); Supplier Footprint: SMD,P=2.54mm,卧贴; JLCPCB Part Class: 扩展库; Datasheet: https://atta.szlcsc.com/upload/public/pdf/source/20240117/9B469DC2C6592C70386B8251DD7D38AB.pdf; Supplier: LCSC; Pin Structure: 1x3P; Pitch: 2.54mm; Mounting Type: 卧贴; Number of Rows: 单排
U13 U14 = MR30PW-M30.G.Y: LCSC Part Name: MR30PW20三芯PCB 弯插公金黄H=3mm; Supplier Part: C19268036; Manufacturer: AMASS(艾迈斯); Datasheet: https://atta.szlcsc.com/upload/public/pdf/source/20231221/E63D24EDC016665263C6304FABBAAC61.pdf; Supplier: LCSC
U15 = TPAL0220F10R0K9: 电阻类型:平面无感功率电阻;阻值:10Ω;精度:±1%;功率:35W;温度系数:±100ppm/℃;; LCSC Part Name: 平面无感功率电阻 10Ω ±1% 35W; Supplier Part: C19633588; Manufacturer: RESI(开步睿思); Supplier Footprint: TO-220; Datasheet: https://atta.szlcsc.com/upload/public/pdf/source/20231215/6A621877FE3E40B51C990ABDF03D7E08.pdf; Supplier: LCSC; Type: 平面无感功率电阻; Tolerance: ±1%; Power(Watts): 35W; Temperature Coefficient: ±100ppm/℃; Operating Temperature Range: -55℃~+150℃

## Nets
+3.3V: C47.2 C48.2 C49.2 C53.2 C54.2 C55.2 C58.1 C59.2 Q18.2(VOUT) R64.2 R65.2 R66.1 R71.2 U5.3(V+) U6.3(V+) U7.3(V+) U8.3(V+) U9.3(V+) U10.3(V+)
+5.8V: C5.2 C6.2 C7.2 C8.2 C9.1 F1.1 L1.2 L2.1 R3.2 R11.2 U2.5(VIN)
+5V: C56.1 C57.2 D1.1(K) FPC1.1 FPC1.2 Q18.3(VIN) R70.2 U11.2 U12.2
+12V: C13.2 C14.2 C31.2 C46.2 D2.1(K) D6.2(A) D7.2(A) D8.2(A) D15.2(A) D16.2(A) D17.2(A) Q1.2(S) R4.2 R6.2 U3.7(VCC) U4.7(VCC)
DGND: C47.1 C48.1 C49.1 C50.1 C51.1 C52.1 C53.1 C54.1 C55.1 C56.2 C57.1 C58.2 C59.1 FPC1.30 LED2.1(K) Q18.1(ADJ/GND) R15.1 R67.2 R68.1 R69.1 U5.2(GND) U6.2(GND) U7.2(GND) U8.2(GND) U9.2(GND) U10.2(GND)
PGND: C1.2 C2.2 C5.1 C6.1 C7.1 C8.1 C9.2 C10.1 C11.1 C12.1 C13.1 C15.1 C16.1 C17.1 C18.1 C19.1 C20.1 C21.1 C22.1 C24.2 C25.2 C26.2 C31.1 C32.1 C33.1 C34.1 C35.1 C36.1 C37.1 C39.2 C40.2 C41.2 C46.1 CN1.1(-) D4.2(A) LED1.2(-) Q4.2(E) Q5.2(E) Q21.2(E) Q22.2(E) R9.1 R10.1 R12.1 R14.2 R15.2 R18.2 R19.2 R41.1 R63.1 R77.2 R79.2 U1.6(GND) U1.9(PowerPAD) U2.2(GND) U3.8(COM) U4.8(COM) U7.4(IN+) U10.4(IN+) U11.1 U12.3 U15.2
PVCC: C1.1 C2.1 C4.2 C10.2 C11.2 C12.2 CN1.2(+) Q2.2(S) Q3.2(S) R1.2 R2.2 R5.2 U1.7(VIN)
VIN: C16.2 C17.2 C18.2 C19.2 C20.2 C21.2 C22.2 C32.2 C33.2 C34.2 C35.2 C36.2 C37.2 C60.2 C61.2 D3.1(K) D5.1(K) Q6.5(D) Q6.6(D) Q6.7(D) Q6.8(D) Q6.9(D) Q7.5(D) Q7.6(D) Q7.7(D) Q7.8(D) Q7.9(D) Q8.5(D) Q8.6(D) Q8.7(D) Q8.8(D) Q8.9(D) Q12.5(D) Q12.6(D) Q12.7(D) Q12.8(D) Q12.9(D) Q13.5(D) Q13.6(D) Q13.7(D) Q13.8(D) Q13.9(D) Q14.5(D) Q14.6(D) Q14.7(D) Q14.8(D) Q14.9(D) Q19.2(S) Q20.2(S) R72.2 R73.2
M0_ADC: FPC1.20 U7.6(OUT)
M0_ADC_A: FPC1.13 U5.6(OUT)
M0_ADC_C: FPC1.14 U8.6(OUT)
M0_BK_OUT: FPC1.5 R76.2
M0_HA: D9.1(K) R20.1 U3.19(HO1)
M0_HB: D10.1(K) R21.1 U3.16(HO2)
M0_HC: D11.1(K) R22.1 U3.13(HO3)
M0_ISENSOR_NA: Q10.1(S) Q10.2(S) Q10.3(S) R34.1 R36.1 R37.1 R41.2 U5.5(IN-) U7.5(IN-) U8.5(IN-)
M0_ISENSOR_PA: Q9.1(S) Q9.2(S) Q9.3(S) R34.2 R35.1 U5.4(IN+)
M0_ISENSOR_PC: Q11.1(S) Q11.2(S) Q11.3(S) R37.2 R38.1 U8.4(IN+)
M0_LA: D12.1(K) R30.1 U3.11(LO1)
M0_LB: D13.1(K) R31.1 U3.10(LO2)
M0_LC: D14.1(K) R33.1 U3.9(LO3)
M0_TIM1_CH1: FPC1.11 U3.3(HIN3)
M0_TIM1_CH1N: FPC1.12 U3.6(LIN3)
M0_TIM1_CH2: FPC1.9 U3.2(HIN2)
M0_TIM1_CH2N: FPC1.10 U3.5(LIN2)
M0_TIM1_CH3: FPC1.7 U3.1(HIN1)
M0_TIM1_CH3N: FPC1.8 U3.4(LIN1)
M0_U: C28.2 Q6.1(S) Q6.2(S) Q6.3(S) Q9.5(D) Q9.6(D) Q9.7(D) Q9.8(D) Q9.9(D) R23.1 R24.2 U3.18(VS1) U13.3
M0_V: C27.2 Q7.1(S) Q7.2(S) Q7.3(S) Q10.5(D) Q10.6(D) Q10.7(D) Q10.8(D) Q10.9(D) R25.1 R26.2 U3.15(VS2) U13.2
M0_W: C23.2 Q8.1(S) Q8.2(S) Q8.3(S) Q11.5(D) Q11.6(D) Q11.7(D) Q11.8(D) Q11.9(D) R27.1 R28.2 U3.12(VS3) U13.1
M1_ADC: FPC1.21 U10.6(OUT)
M1_ADC_A: FPC1.22 U6.6(OUT)
M1_ADC_C: FPC1.23 U9.6(OUT)
M1_BK_OUT: FPC1.6 R78.2
M1_HA: D18.1(K) R42.1 U4.19(HO1)
M1_HB: D19.1(K) R43.1 U4.16(HO2)
M1_HC: D20.1(K) R44.1 U4.13(HO3)
M1_ISENSOR_NA: Q16.1(S) Q16.2(S) Q16.3(S) R56.1 R58.1 R59.1 R63.2 U6.5(IN-) U9.5(IN-) U10.5(IN-)
M1_ISENSOR_PA: Q15.1(S) Q15.2(S) Q15.3(S) R56.2 R57.1 U6.4(IN+)
M1_ISENSOR_PC: Q17.1(S) Q17.2(S) Q17.3(S) R59.2 R60.1 U9.4(IN+)
M1_LA: D21.1(K) R52.1 U4.11(LO1)
M1_LB: D22.1(K) R53.1 U4.10(LO2)
M1_LC: D23.1(K) R55.1 U4.9(LO3)
M1_TIM8_CH1: FPC1.28 U4.3(HIN3)
M1_TIM8_CH1N: FPC1.29 U4.6(LIN3)
M1_TIM8_CH2: FPC1.26 U4.2(HIN2)
M1_TIM8_CH2N: FPC1.27 U4.5(LIN2)
M1_TIM8_CH3: FPC1.24 U4.1(HIN1)
M1_TIM8_CH3N: FPC1.25 U4.4(LIN1)
M1_U: C43.2 Q12.1(S) Q12.2(S) Q12.3(S) Q15.5(D) Q15.6(D) Q15.7(D) Q15.8(D) Q15.9(D) R45.1 R46.2 U4.18(VS1) U14.3
M1_V: C42.2 Q13.1(S) Q13.2(S) Q13.3(S) Q16.5(D) Q16.6(D) Q16.7(D) Q16.8(D) Q16.9(D) R47.1 R48.2 U4.15(VS2) U14.2
M1_W: C38.2 Q14.1(S) Q14.2(S) Q14.3(S) Q17.5(D) Q17.6(D) Q17.7(D) Q17.8(D) Q17.9(D) R49.1 R50.2 U4.12(VS3) U14.1
MOTOR_EN1: FPC1.4 R16.2
MOTOR_EN2: FPC1.3 R17.2
S0_PWM: FPC1.18 U11.3
S1_PWM: FPC1.19 U12.1
TEMP0_ADC: C50.2 FPC1.16 R64.1 R68.2
TEMP1_ADC: C51.2 FPC1.17 R65.1 R69.2
VOLTAGE_ADC: FPC1.15 R13.1
VREF: C52.2 R66.2 R67.1 U5.1(REF) U6.1(REF) U7.1(REF) U8.1(REF) U9.1(REF) U10.1(REF)
$1N915: D1.2(A) F1.2
$1N1850: R11.1 U2.4(EN)
$1N2022: R4.1 R12.2 U2.3(FB)
$1N3202: Q5.1(B) R17.1 R19.1
$1N3206: C4.1 Q2.1(G) Q3.1(G) R1.1 R8.2
$1N3210: Q5.3(C) R8.1
$1N3644: C15.2 R5.1 R13.2 R14.1
$1N7751: C28.1 D8.1(K) U3.20(VB1)
$1N7797: C27.1 D7.1(K) U3.17(VB2)
$1N7802: C23.1 D6.1(K) U3.14(VB3)
$1N8638: D9.2(A) Q6.4(G) R20.2 R23.2
$1N9075: C24.1 R24.1
$1N9358: D12.2(A) Q9.4(G) R30.2 R35.2
$1N10733: D10.2(A) Q7.4(G) R21.2 R25.2
$1N10760: C25.1 R26.1
$1N10771: D13.2(A) Q10.4(G) R31.2 R36.2
$1N11350: D11.2(A) Q8.4(G) R22.2 R27.2
$1N11377: C26.1 R28.1
$1N11388: D14.2(A) Q11.4(G) R33.2 R38.2
$1N20159: D22.2(A) Q16.4(G) R53.2 R58.2
$1N20164: D21.2(A) Q15.4(G) R52.2 R57.2
$1N20183: C40.1 R48.1
$1N20187: D19.2(A) Q13.4(G) R43.2 R47.2
$1N20191: C39.1 R46.1
$1N20194: D18.2(A) Q12.4(G) R42.2 R45.2
$1N20215: D23.2(A) Q17.4(G) R55.2 R60.2
$1N20218: C41.1 R50.1
$1N20219: D20.2(A) Q14.4(G) R44.2 R49.2
$1N20229: C43.1 D17.1(K) U4.20(VB1)
$1N20256: C42.1 D16.1(K) U4.17(VB2)
$1N20257: C38.1 D15.1(K) U4.14(VB3)
$1N36343: LED1.1(+) R70.1
$1N36459: LED2.2(A) R71.1
$1N64887: Q4.1(B) R16.1 R18.1
$1N64889: Q4.3(C) R7.1
$1N69829: C14.1 Q1.1(G) R6.1 R7.2
$1N79068: D3.2(A) Q1.3(D)
$1N124629: D5.2(A) Q2.3(D) Q3.3(D)
$1N126042: D24.2(A) Q19.3(D)
$1N126056: Q21.1(B) R76.1 R77.1
$1N126057: Q21.3(C) R74.1
$1N126058: C60.1 Q19.1(G) R72.1 R74.2
$1N126455: D25.2(A) Q20.3(D)
$1N126462: Q22.1(B) R78.1 R79.1
$1N126467: C61.1 Q20.1(G) R73.1 R75.2
$1N126474: Q22.3(C) R75.1
$1N126564: D24.1(K) D25.1(K) U15.1
$1N167795: R2.1 R9.2 U1.5(ENA)
$1N168255: C3.1 U1.1(BOOT)
$1N168264: C3.2 D4.1(K) L1.1 U1.8(PH)
$1N168458: R3.1 R10.2 U1.4(VSENSE)
$1N213205: D2.2(A) L2.2 U2.1(SW)

Not connected (* = marked no-connect by the designer): CN1 3* 4*; FPC1 31* 32*; U1 2(NC)* 3(NC)*; U2 6(OC)*; U13 4* 5*; U14 4* 5*

## Notes on the sheet
- 电源1
- PVCC-5V-12V
- 电源2
- PVCC
- 电压检测
- VGS=-12*(R7/R6+R7)=-6V
- VGS=-PVCC*(R15/R14+R15)
  =|-1/2PVCCV|<20V
- VOUT=1.221*(R3/R11+1)=5.846V
- VOUT=0.6*(R4/R13+1)=12.6V
- 需要35-50V
- M0驱动
- M1驱动
- 检测电路
- NTC
- 电源3
- LED
- 5V-3.3V
- 舵机接口
- 刹车电路
- 功率接口
- FPC接口
- R=24*24/24*0.3=7.2
